# Altium schematic sheet analog_frontend.SchDoc: SoPC Oscilloscope - Analog Interface
size A; DrawnBy: Santiago Navonne; Revision: 1.1; SheetNumber: 3; SheetTotal: 5
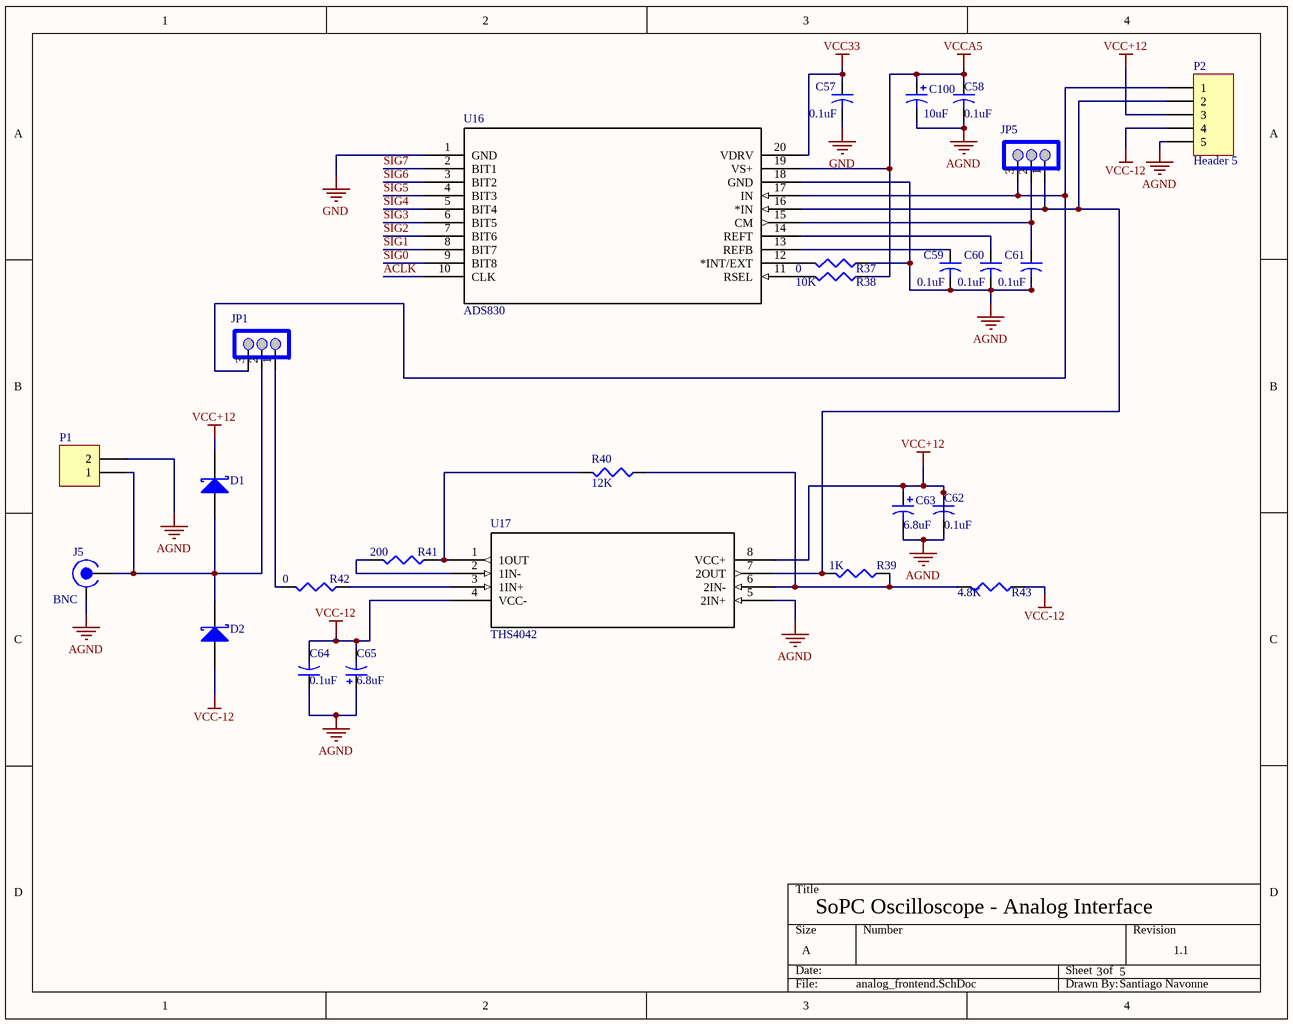
[diagram p0: analog_frontend.SchDoc]

## Parts
C57  value 0.1uF  [CAPC1608L]  (hidden comment: Cap2)
C58  value 0.1uF  [CAPC1608L]  (hidden comment: Cap2)
C59  value 0.1uF  [CAPC1608L]  (hidden comment: Cap2)
C60  value 0.1uF  [CAPC1608L]  (hidden comment: Cap2)
C61  value 0.1uF  [CAPC1608L]  (hidden comment: Cap2)
C62  value 0.1uF  [CAPC1608L]  (hidden comment: Cap2)
C63  value 6.8uF  [C2413]  (hidden comment: Cap Pol3)
C64  value 0.1uF  [CAPC1608L]  (hidden comment: Cap2)
C65  value 6.8uF  [C2413]  (hidden comment: Cap Pol3)
C100  value 10uF  [CAPC3216N]  (hidden comment: Cap Pol3)
D1  D Schottky  [PowerDI123]  (value not drawn)
D2  D Schottky  [PowerDI123]  (value not drawn)
J5  BNC  [AMP31-5540]
JP1  AIN  [HDR1X3]  (value not drawn)
JP5  AIN  [HDR1X3]  (value not drawn)
P1  Header 2  [HDR1X2]  (value not drawn)
P2  Header 5  [HDR1X5]
R37  value 0  [RESC1608N]  (hidden comment: Res3)
R38  value 10K  [RESC1608N]  (hidden comment: Res3)
R39  value 1K  [RESC1608N]  (hidden comment: Res3)
R40  value 12K  [RESC1608N]  (hidden comment: Res3)
R41  value 200  [RESC1608N]  (hidden comment: Res3)
R42  value 0  [RESC1608N]  (hidden comment: Res3)
R43  value 4.8K  [RESC1608N]  (hidden comment: Res3)
U16  ADS830  [DBQ20]
U17  THS4042  [D8]

## Nets
AGND: C58.2 C59.2 C60.2 C61.2 C62.2 C63.2 C64.1 C65.1 C100.2 J5.2(SHIELD) P1.2 P2.5 R37.1 U16.18(GND) U17.5(2IN+)
GND: C57.2 U16.1(GND)
VCC33: C57.1 U16.20(VDRV)
VCC+12: C62.1 C63.1 D1.K P2.3 U17.8(VCC+)
VCC-12: C64.2 C65.2 D2.A P2.4 R43.1 U17.4(VCC-)
VCCA5: C58.1 C100.1 R38.1 U16.19(VS+)
ACLK: U16.10(CLK)
SIG0: U16.9(BIT8)
SIG1: U16.8(BIT7)
SIG2: U16.7(BIT6)
SIG3: U16.6(BIT5)
SIG4: U16.5(BIT4)
SIG5: U16.4(BIT3)
SIG6: U16.3(BIT2)
SIG7: U16.2(BIT1)
NetC59_1: C59.1 U16.13(REFB)
NetC60_1: C60.1 U16.14(REFT)
NetC61_1: C61.1 JP5.2(J2) U16.15(CM)
NetD1_A: D1.A D2.K J5.1(SIGNAL) JP1.2(J2) P1.1
NetJP1_1: JP1.1(J1) R42.2
NetJP1_3: JP1.3(J3) JP5.3(J3) P2.1 U16.17(IN)
NetJP5_1: JP5.1(J1) P2.2 R39.2 U16.16(*IN) U17.7(2OUT)
NetR37_2: R37.2 U16.12(*INT/EXT)
NetR38_2: R38.2 U16.11(RSEL)
NetR39_1: R39.1 R40.1 R43.2 U17.6(2IN-)
NetR40_2: R40.2 R41.1 U17.1(1OUT)
NetR41_2: R41.2 U17.2(1IN-)
NetR42_1: R42.1 U17.3(1IN+)

## Library data of the parts
C57-C62 C64 = Cap2: Capacitor; Published: 23-Sep-2002; PackageReference: CAPR5-4X5; Publisher: Altium Limited; PackageDescription: Capacitor; 2 Leads
C63 C65 C100 = Cap Pol3: Polarized Capacitor (Surface Mount); Published: 8-Jun-2000; LatestRevisionDate: 29-May-2009; LatestRevisionNote: IPC-7351 Footprint Added.; PackageReference: C0805; Publisher: Altium Limited; PackageDescription: Chip Capacitor
D1 D2 = D Schottky: Schottky Diode; Published: 8-Jun-2000; LatestRevisionDate: 17-Jul-2002; LatestRevisionNote: Re-released for DXP Platform.; PackageReference: SMB; Publisher: Altium Limited; PackageDescription: DO-214-AA/SMB; 2 C-Bend Leads; Body 5.3 x 3.6 mm, inc. leads (LxW); Code_JEDEC: DO-214-AA
J5 = BNC: BNC Connector
JP1 JP5 = JUMPER3SM
P1 = Header 2: Header, 2-Pin; LatestRevisionDate: 17-Jul-2002; LatestRevisionNote: Re-released for DXP Platform.; Publisher: Altium Limited
P2 = Header 5: Header, 5-Pin; LatestRevisionDate: 17-Jul-2002; LatestRevisionNote: Re-released for DXP Platform.; Publisher: Altium Limited
R37-R43 = Res3: Resistor; Published: 8-Jun-2000; LatestRevisionDate: 29-May-2009; LatestRevisionNote: IPC-7351 Footprint Added.; PackageReference: J1-0603; Publisher: Altium Limited; PackageDescription: Chip Resistor
U16 = ADS830_DBQ_20: Imported; Manufacturer: Texas Instruments; INDUSTRY_STD_PKG_TYPE: SSOP/QSOP; FAMILY_NAME: HIGH SPEED ADC (>10MSPS); PIN_COUNT: 20; PACKAGE_DESIGNATOR: DBQ; Datasheet URL: http://www.ti.com/lit/gpn/ADS830; GENERIC_PART_NUMBER: ADS830; RefDes: RefDes; Type: DEV; Value: Value
U17 = THS4042_D_8: Imported; Vendor: Texas Instruments; PACKAGE_DESIGNATOR: D; PIN_COUNT: 8; FAMILY_NAME: VOLTAGE FEEDBACK; INDUSTRY_STD_PKG_TYPE: SOIC; Manufacturer_Part_Number: ths4042_d_8; GENERIC_PART_NUMBER: THS4042; Datasheet URL: http://www.ti.com/lit/gpn/THS4042; Manufacturer: Texas Instruments; RefDes: RefDes; Type: DEV; Value: Value